# EAGLE design synth-zodiac-aquarius-vco (EAGLE 9.6.2)
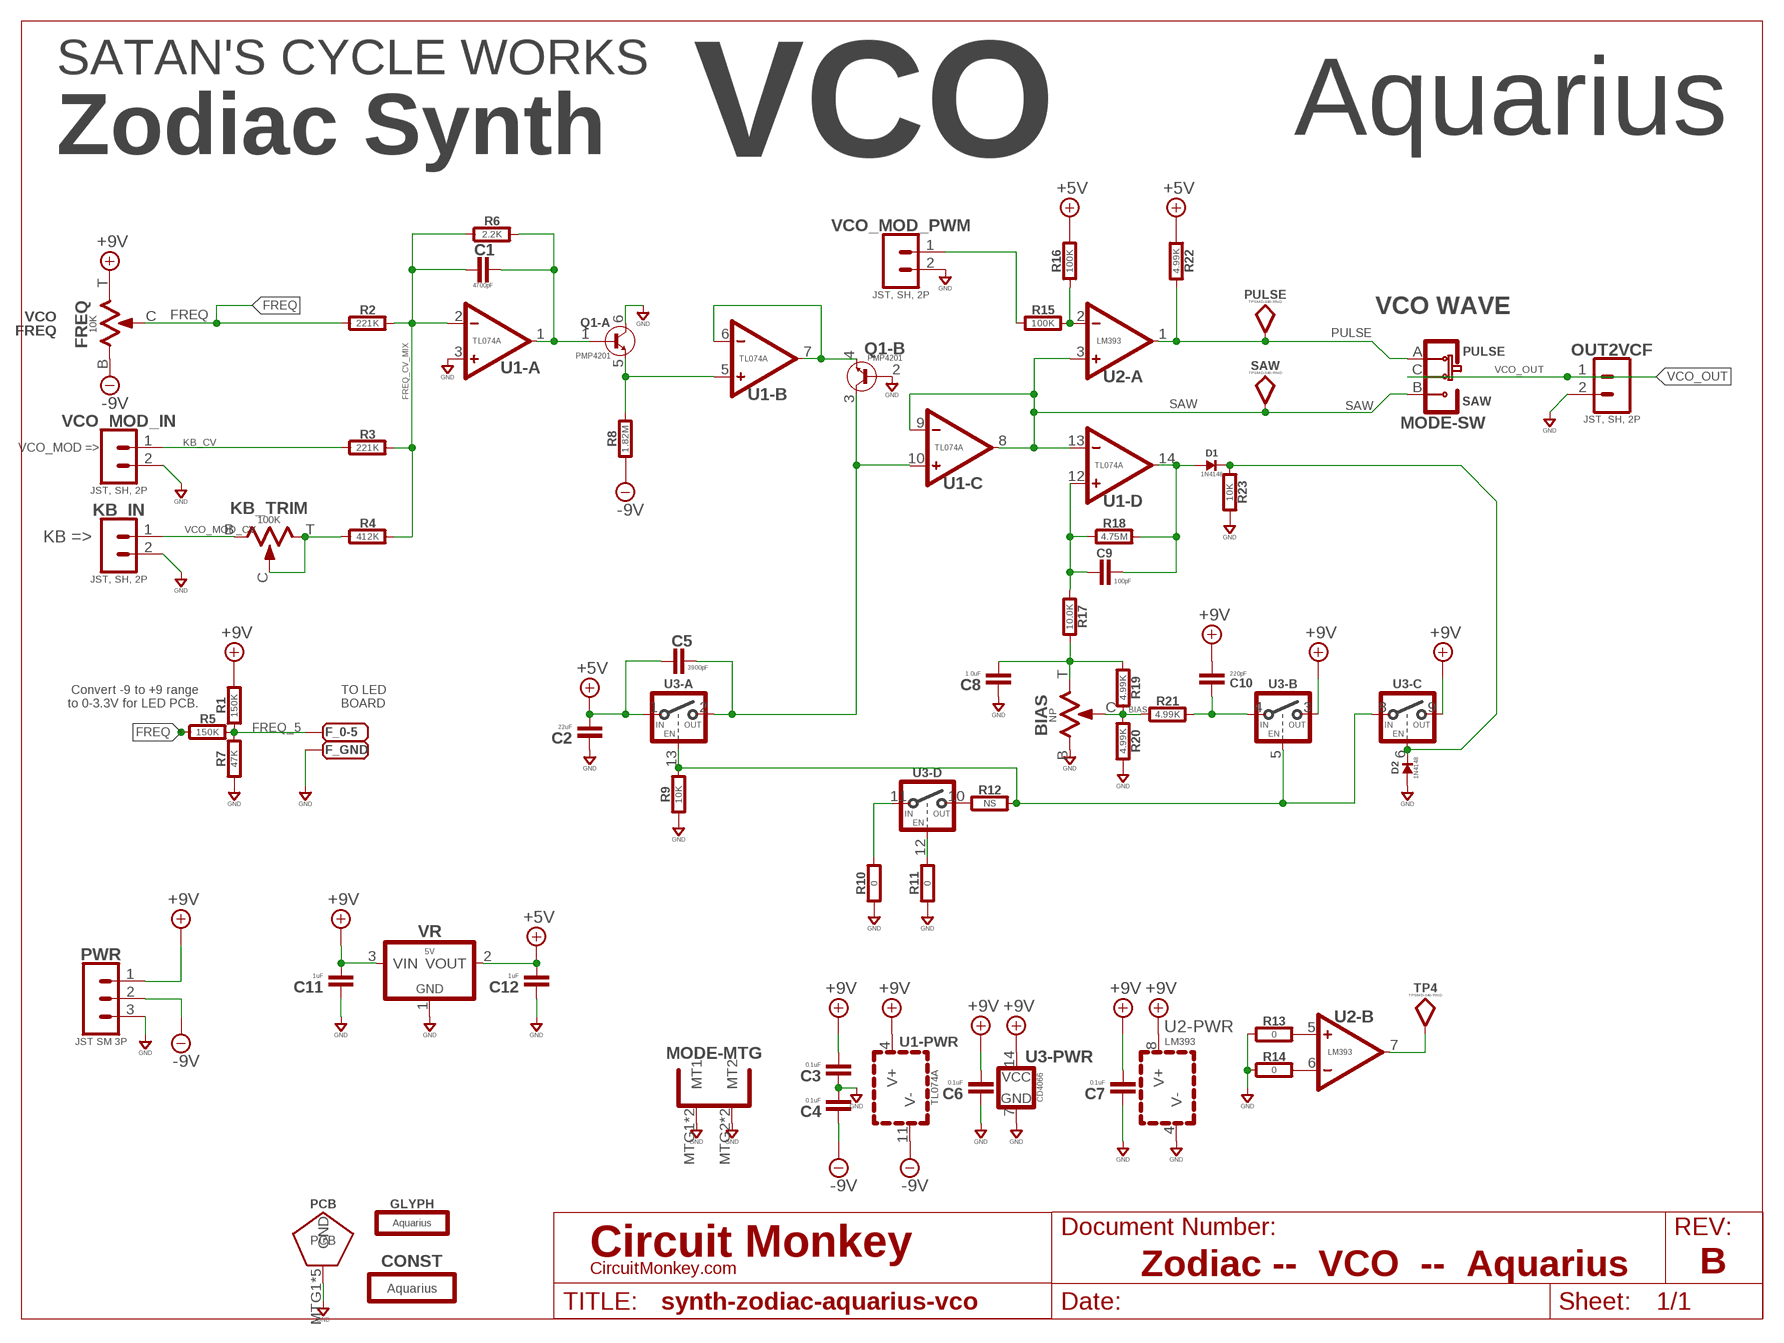
[diagram p0: schematic, sheet 1]
SHEET1 (LETTER_L-CIRCUITMONKEY): DOCUMENT_NUMBER: Zodiac -- VCO -- Aquarius; REV: B

## Parts
BIAS  NP  TRIMPOTTC33X  [TRIM_BOURNS_TC33X]
C1  4700pF  CAPACITOR0603  [0603-CAP]
C2  22uF  CAPACITOR0603  [0603-CAP]
C3  0.1uF  CAPACITOR0603  [0603-CAP]
C4  0.1uF  CAPACITOR0603  [0603-CAP]
C5  3900pF  CAPACITOR0603  [0603-CAP]
C6  0.1uF  CAPACITOR0603  [0603-CAP]
C7  0.1uF  CAPACITOR0603  [0603-CAP]
C8  1.0uF  CAPACITOR0603  [0603-CAP]
C9  100pF  CAPACITOR0603  [0603-CAP]
C10  220pF  CAPACITOR0603  [0603-CAP]
C11  1uF  CAPACITOR0603  [0603-CAP]
C12  1uF  CAPACITOR0603  [0603-CAP]
CONST  Aquarius  CONSTELLATION-AQUARIUS  [AQUARIUS-CONST]
D1  1N4148  DIODE-1N4148  [SOD-123]
D2  1N4148  DIODE-1N4148  [SOD-123]
F_0-5  PADSMD-070X070  [SMD-070MIL]
F_GND  PADSMD-070X070  [SMD-070MIL]
FREQ  10K  TRIMPOT9MM_PCB_SHAFT  [POT-RV9110]
GLYPH  Aquarius  GLYPH-AQUARIUS  [AQUARIUS-GLYPH]
KB_IN  JST, SH, 2P  02P-SM-VT-SMT  [BM02B-SRSS-TB]
KB_TRIM  100K  TRIMPOTTC33X  [TRIM_BOURNS_TC33X]
MODE  SLIDE-SPDT-MNTSS-12-F45-TH-PCB-2  [SS-12-F45-PNL-SMT-2]
OUT2VCF  JST, SH, 2P  02P-SM-VT-SMT  [BM02B-SRSS-TB]
PCB  PCB FAB  PENTAGON-40R  [PENTAGON-40MM-RAD]
PULSE  TPSMD-040-RND  [SMD-040MIL-RND]
PWR  JST SM 3P  03P-SM-VT-SMT  [BM03B-SRSS-TB]
Q1  PMP4201  NPN-DUALPMP4201  [SOT666]
R1  150K  RESISTOR0603  [0603-RES]
R2  221K  RESISTOR0603  [0603-RES]
R3  221K  RESISTOR0603  [0603-RES]
R4  412K  RESISTOR0603  [0603-RES]
R5  150K  RESISTOR0603  [0603-RES]
R6  2.2K  RESISTOR0603  [0603-RES]
R7  47K  RESISTOR0603  [0603-RES]
R8  1.82M  RESISTOR0603  [0603-RES]
R9  10K  RESISTOR0603  [0603-RES]
R10  0  RESISTOR0603  [0603-RES]
R11  0  RESISTOR0603  [0603-RES]
R12  NS  RESISTOR0603  [0603-RES]
R13  0  RESISTOR0603  [0603-RES]
R14  0  RESISTOR0603  [0603-RES]
R15  100K  RESISTOR0603  [0603-RES]
R16  100K  RESISTOR0603  [0603-RES]
R17  10.0K  RESISTOR0603  [0603-RES]
R18  4.75M  RESISTOR0603  [0603-RES]
R19  4.99K  RESISTOR0603  [0603-RES]
R20  4.99K  RESISTOR0603  [0603-RES]
R21  4.99K  RESISTOR0603  [0603-RES]
R22  4.99K  RESISTOR0603  [0603-RES]
R23  10K  RESISTOR0603  [0603-RES]
SAW  TPSMD-040-RND  [SMD-040MIL-RND]
TP4  TPSMD-040-RND  [SMD-040MIL-RND]
U1  TL074A  QUADTL074A-SOIC  [SOP14]
U2  LM393  DUAL-LM393ED  [SOP08]
U3  CD4066  CD4066SO14  [SOP14]
VCO_MOD_IN  JST, SH, 2P  02P-SM-VT-SMT  [BM02B-SRSS-TB]
VCO_MOD_PWM  JST, SH, 2P  02P-SM-VT-SMT  [BM02B-SRSS-TB]
VR  5V  LDO-3P--5V-SOT23  [SOT-23]

## Nets
+5V: C2.2 C5.1 C12.2 R16.2 R22.1 U3.1(-A:IN) VR.2(VOUT)
+9V: C3.2 C6.2 C7.2 C10.2 C11.2 FREQ.T PWR.1 R1.2 U1.4(-PWR:V+) U2.8(-PWR:V+) U3.3(-B:OUT) U3.9(-C:OUT) U3.14(-PWR:VCC) VR.3(VIN)
-9V: C4.1 FREQ.B PWR.2 R8.1 U1.11(-PWR:V-)
BIAS: BIAS.C R19.2 R20.1 R21.1
FREQ: FREQ.C R2.1 R5.1
FREQ_5: F_0-5.1(PAD) R1.1 R5.2 R7.2
FREQ_CV_MIX: C1.1 R2.2 R3.2 R4.2 R6.1 U1.2(-A:-)
GND: BIAS.B C2.1 C3.1 C4.2 C6.1 C7.1 C8.1 C11.1 C12.1 D2.A F_GND.1(PAD) KB_IN.2 MODE.MTG1(-MTG:MT1) MODE.MTG2(-MTG:MT2) MODE.MTG3(-MTG:MT1) MODE.MTG4(-MTG:MT2) OUT2VCF.2 PCB.MTG1(GND) PCB.MTG2(GND) PCB.MTG3(GND) PCB.MTG4(GND) PCB.MTG5(GND) PWR.3 Q1.2(-B:BASE) Q1.6(-A:COLLECTOR) R7.1 R9.1 R10.1 R11.1 R13.1 R14.1 R20.2 R23.2 U1.3(-A:+) U2.4(-PWR:V-) U3.7(-PWR:GND) VCO_MOD_IN.2 VCO_MOD_PWM.2 VR.1(GND)
KB_CV: KB_IN.1 KB_TRIM.B
N$8: KB_TRIM.C KB_TRIM.T R4.1
N$12: Q1.5(-A:EMITTER) R8.2 U1.5(-B:+)
N$13: Q1.4(-B:EMITTER) U1.6(-B:-) U1.7(-B:OUT)
N$14: C1.2 Q1.1(-A:BASE) R6.2 U1.1(-A:OUT)
N$15: R9.2 R12.2 U3.5(-B:EN) U3.8(-C:IN) U3.13(-A:EN)
N$16: C9.1 R17.1 R18.1 U1.12(-D:+)
N$17: R14.2 U2.6(-B:-)
N$18: C9.2 D1.A R18.2 U1.14(-D:OUT)
N$20: C5.2 Q1.3(-B:COLLECTOR) U1.10(-C:+) U3.2(-A:OUT)
N$21: BIAS.T C8.2 R17.2 R19.1
N$22: C10.1 R21.2 U3.4(-B:IN)
N$23: R12.1 U3.10(-D:OUT)
N$24: D1.K D2.K R23.1 U3.6(-C:EN)
N$25: R10.2 U3.11(-D:IN)
N$26: R11.2 U3.12(-D:EN)
N$27: R13.2 U2.5(-B:+)
N$28: R15.2 R16.1 U2.2(-A:-)
N$29: TP4.TP U2.7(-B:OUT)
PULSE: MODE.A(-SW:A) PULSE.TP R22.2 U2.1(-A:OUT)
PWM_CV: R15.1 VCO_MOD_PWM.1
SAW: MODE.B(-SW:B) SAW.TP U1.8(-C:OUT) U1.9(-C:-) U1.13(-D:-) U2.3(-A:+)
VCO_MOD_CV: R3.1 VCO_MOD_IN.1
VCO_OUT: MODE.C(-SW:C) OUT2VCF.1

## Notes on the sheet
- VCO | Aquarius
- SATAN'S CYCLE WORKS
- Zodiac Synth
- VCO WAVE
- VCO
  FREQ
- PULSE
- SAW
- VCO_MOD =>
- KB =>
- Convert -9 to +9 range
  to 0-3.3V for LED PCB.
- TO LED
  BOARD

## Library data of the parts
BIAS KB_TRIM = rlc:TRIMPOT: Potentiometer; MFR: Bourns; MPN: TC33X
C1-C12 = rlc:CAPACITOR: Capacitor; COST01: 0.12; COST10: 0.09; COST100: 0.05
CONST = circuit-monkey-zodiac:CONSTELLATION: Constellations
D1 D2 = diodes:DIODE-: Diode; COST01: 0.20; COST10: 0.18; COST100: 0.10; MPN: 1N4148W
F_0-5 F_GND = con-testpoints:PAD: Solder Pad
FREQ = rlc:TRIMPOT: Potentiometer; COST01: 0.70; COST10: 0.60; COST100: 0.60; MFR: Tayda; MPN: RV9110NO-OS15A00; SKU: A-5517
GLYPH = circuit-monkey-zodiac:GLYPH: Glyph
KB_IN OUT2VCF VCO_MOD_IN VCO_MOD_PWM = con-jst:02P: 2 pin connector; COST01: 0.45; COST10: 0.4; COST100: 0.35; MFR: JST; MPN: BMB02B-SRSS-TB
MODE = switch-thd:SLIDE-SPDT-MNT: Slide Switch, SPDT; COST01: 0.15; COST10: 0.12; COST100: 0.12; MFR: Tayda; MPN: A-659/A-5111/A-5104
PCB = circuit-monkey-zodiac:PENTAGON: Pentagram shaped PCB
PULSE SAW TP4 = con-testpoints:TP: Test Point -- Testpoint
PWR = con-jst:03P: 3 pin connector; COST01: 0.60; COST10: 0.45; COST100: 0.38; MFR: JST; MPN: BM03B-SRSS-TB
Q1 = transistor-bjt:NPN-DUAL: Dual NPN Transistor; COST01: 0.55; COST10: 0.45; COST100: 0.35; MFR: NXP; MPN: PMP4201V
R1-R23 = rlc:RESISTOR: Resistor; COST01: 0.10; COST10: 0.05; COST100: 0.02
U1 = op-amp:QUAD: Quad Op-amp; COST01: 0.95; COST10: 0.70; COST100: 0.55; MFR: ST; MPN: TL074ACDT
U2 = op-amp:DUAL: Dual Op-Amp; COST01: 0.40; COST10: 0.32; COST100: 0.20; MFR: ST; MPN: LM393ED
U3 = logic:CD4066: CD4066 Analog Switch; COST01: 0.55; COST10: 0.45; COST100: 0.35; MFR: TI; MPN: CD4066BM
VR = regulators:LDO-3P-: regulator 3-pin; COST01: 0.66; COST10: 0.56; COST100: 0.39; MFR: Diodes, Inc.; MPN: AP7387-50SA

## Board
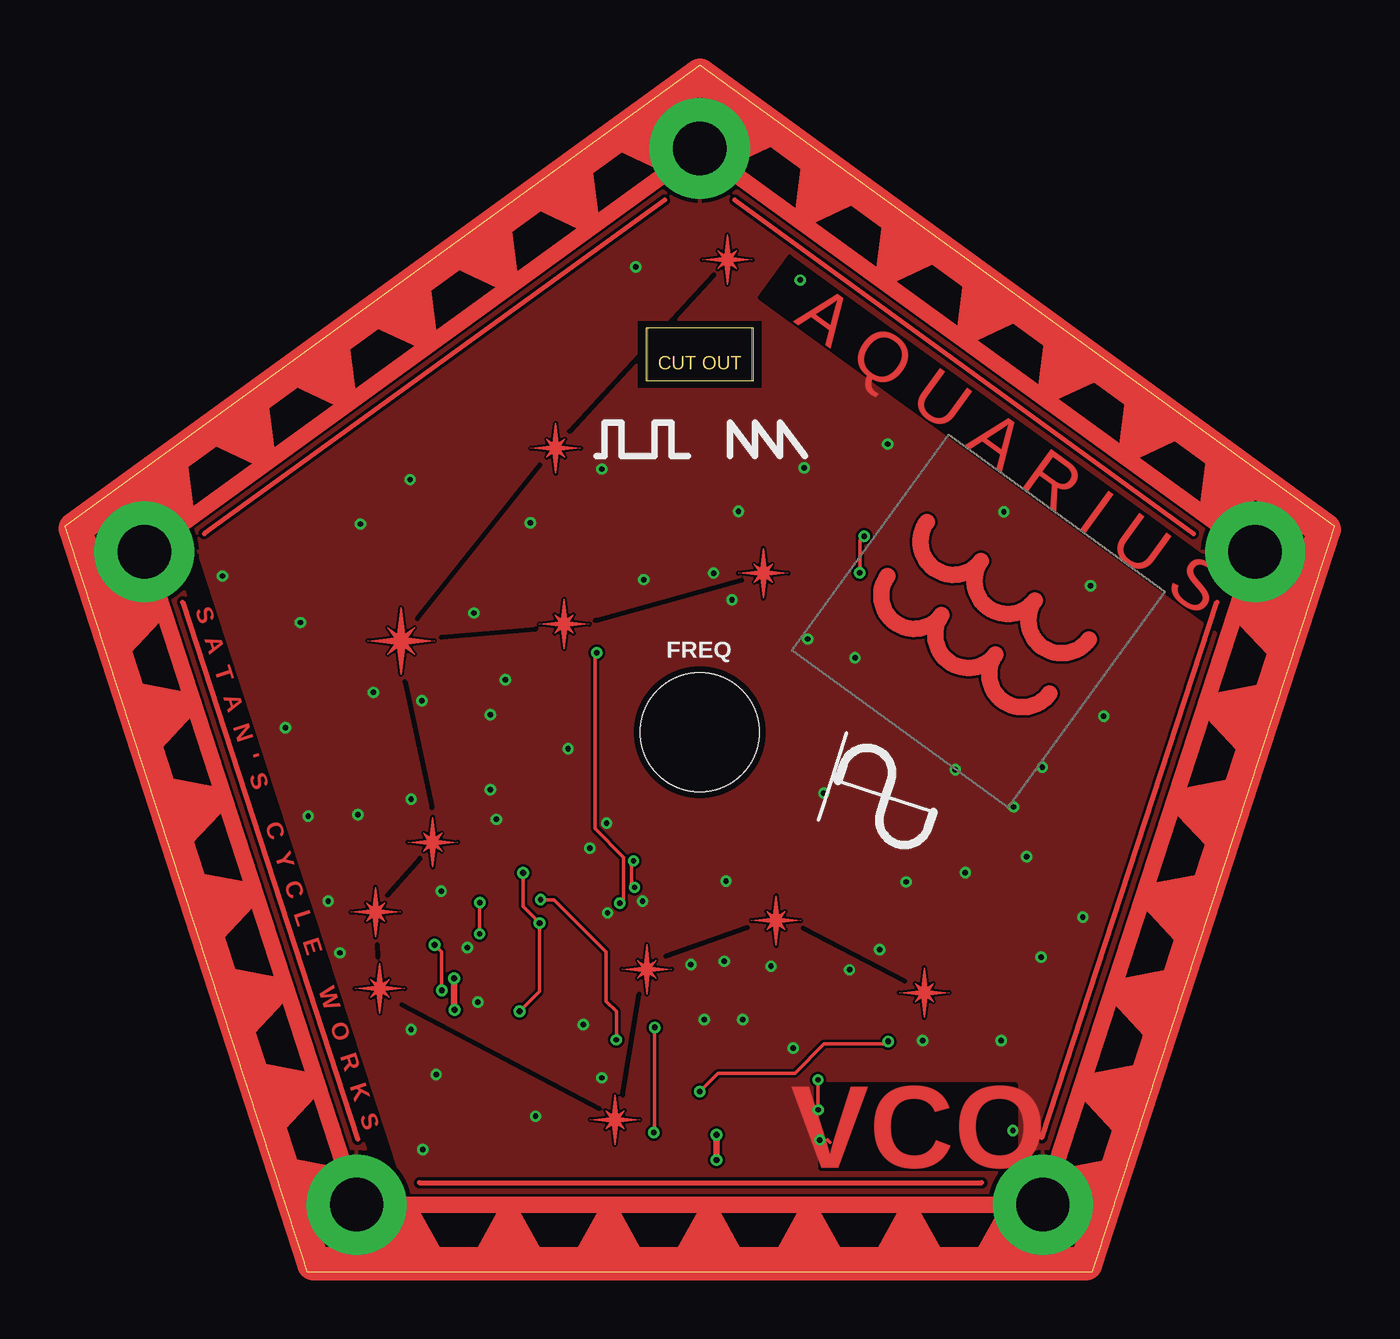
[diagram p1: board, top side]
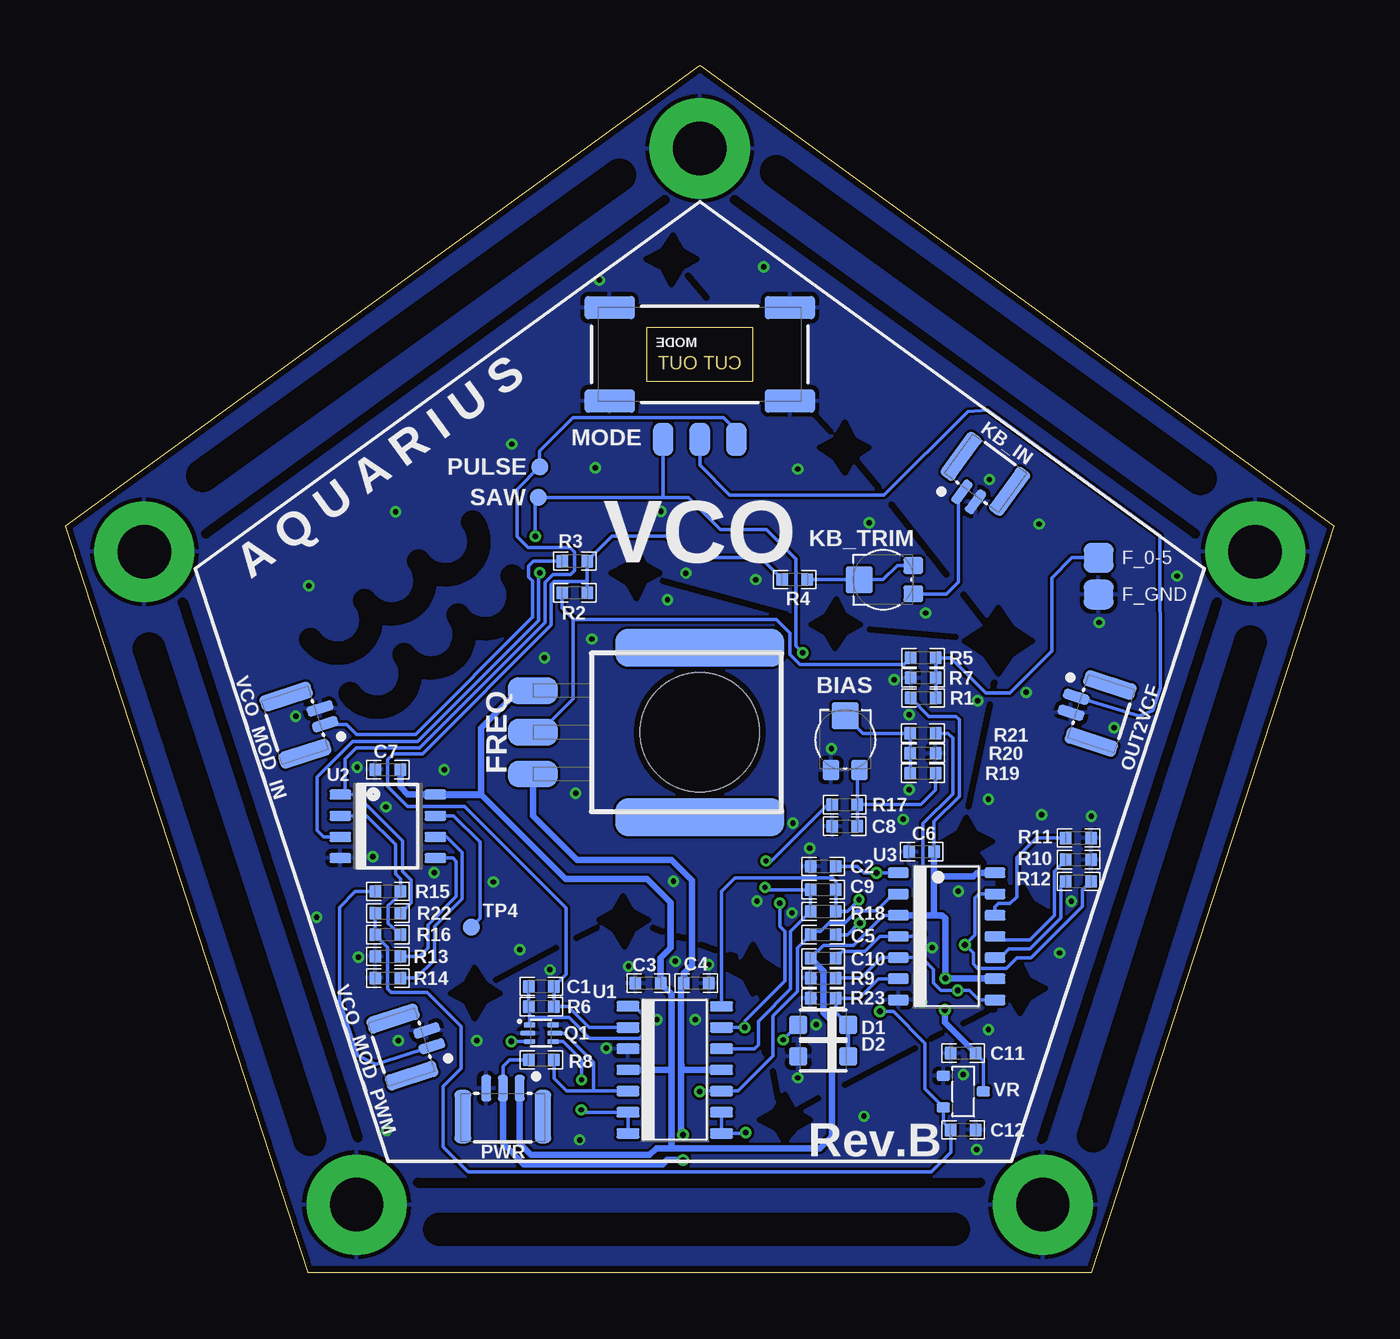
[diagram p2: board, bottom side, seen from below]

Size 76.08 x 72.36 mm. Coordinates in mm from the lower left corner, seen from the top.
Copper layers (1*16): Top 0.0356mm / dielectric 1.5011mm / Bottom 0.0356mm
Design rules "OSH-CircuitMonkey *": minimum track width 0.2mm, minimum drill 12mil, track to track 0.15mm, track to pad 0.15mm, pad to pad 0.15mm, via to via 0.15mm, smd to smd 0.15mm, copper to edge 15mil, drill to drill 6mil, minimum pad ring 7mil, minimum via ring 7mil, stop-mask expansion 3mil, vias tented up to drill 14mil, thermal gap 10mil
bRestrict: area 38.2,59.2 to 41.2,62.1; area 27.9,47.9 to 30.8,50.9; area 18.1,35.9 to 22.1,39.8; area 20.5,24.3 to 23.5,27.2; area 17.2,20.2 to 19.4,23; area 17.3,15.6 to 20.3,18.5; area 31.4,8 to 34.4,10.6; area 33.4,16.7 to 36.2,19.6; area 41.1,19.5 to 44,22.5; area 50,15.2 to 52.9,18.2; area 28.4,37.4 to 31.3,40.3; area 40.4,40.4 to 43.3,43.3; 29 lines

### Footprints (pad centres in the part's own frame; a part is rotated, then mirrored left to right if it is on the bottom)
TRIM_BOURNS_TC33X = smd 1 x 1.2: B -0.85,-1.8; T 0.85,-1.8 | smd 1.6 x 1.6: C 0,1.45
0603-CAP = smd 0.711 x 0.762: 1 -0.752,0; 2 0.752,0
SOD-123 = smd 1.1 x 1.1: A 1.5,0; K -1.5,0
SMD-070MIL = smd 1.778 x 1.778: 1 0.508,0
POT-RV9110 = smd 1.6 x 3: B 2.5,-10; C 0,-10; T -2.5,-10 | smd 2.286 x 10.16: MNT1 -5.08,0; MNT2 5.08,0 | hole 7.1: 0,0
BM02B-SRSS-TB = smd 0.6 x 1.6: 1 -0.5,-0.3; 2 0.5,-0.3 | smd 1 x 3.2: MTG1 1.8,1.4; MTG2 -1.8,1.4
SS-12-F45-PNL-SMT-2 = smd 1.2 x 2 bottom: A -2.2,-5.1; B 2.2,-5.1; C 0,-5.1 | smd 3 x 1.4 bottom: MTG1 -5.4,2.8; MTG2 5.4,2.8; MTG3 -5.4,-2.8; MTG4 5.4,-2.8
PENTAGON-40MM-RAD = drill 3.2 pad 6: MTG1 0,35; MTG2 33.3,10.82; MTG3 20.57,-28.32; MTG4 -20.57,-28.32; MTG5 -33.3,10.82
SMD-040MIL-RND = smd 1.016 x 1.016: TP 0,0
BM03B-SRSS-TB = smd 0.6 x 1.6: 1 -1,-0.3; 2 0,-0.3; 3 1,-0.3 | smd 1 x 3.2: MTG1 2.4,1.4; MTG2 -2.4,1.4
SOT666 = smd 0.32 x 0.7: 1 -0.5,-0.7; 3 0.5,-0.7; 4 0.5,0.7; 6 -0.5,0.7 | smd 0.32 x 0.9: 2 0,-0.8; 5 0,0.8
0603-RES = smd 0.711 x 0.762: 1 -0.752,0; 2 0.752,0
SOP14 = smd 1.4 x 0.635: 1 -2.8,3.81 | smd 1.4 x 0.63: 2 -2.8,2.54; 3 -2.8,1.27; 4 -2.8,0; 5 -2.8,-1.27; 6 -2.8,-2.54; 7 -2.8,-3.81; 8 2.8,-3.81; 9 2.8,-2.54; 10 2.8,-1.27; 11 2.8,0; 12 2.8,1.27; 13 2.8,2.54; 14 2.8,3.81
SOP08 = smd 0.6 x 1.3: 1 -1.905,-2.85; 2 -0.635,-2.85; 3 0.635,-2.85; 4 1.905,-2.85; 5 1.905,2.85; 6 0.635,2.85; 7 -0.635,2.85; 8 -1.905,2.85
SOP14' = smd 1.27 x 0.635: 1 -2.9,3.81; 2 -2.9,2.54; 3 -2.9,1.27; 4 -2.9,0; 5 -2.9,-1.27; 6 -2.9,-2.54; 7 -2.9,-3.81; 8 2.9,-3.81; 9 2.9,-2.54; 10 2.9,-1.27; 11 2.9,0; 12 2.9,1.27; 13 2.9,2.54; 14 2.9,3.81
SOT-23 = smd 0.6 x 0.8: 1 0.95,1.2; 2 -0.95,1.2; 3 0,-1.2

### Placement (x,y rotation side)
BIAS  29.32,31.9 0 bottom
C1  47.54,17.12 180 bottom
C2  30.64,24.32 0 bottom
C3  41.14,17.32 0 bottom
C4  38.24,17.32 0 bottom
C5  30.64,20.22 180 bottom
C6  24.74,25.2 0 bottom
C7  56.74,30.12 0 bottom
C8  29.34,26.72 0 bottom
C9  30.64,22.92 0 bottom
C10  30.64,18.82 180 bottom
C11  22.24,13.12 0 bottom
C12  22.24,8.52 180 bottom
CONST  33.34,30.72 0 top
D1  30.64,14.82 180 bottom
D2  30.64,12.92 180 bottom
F_0-5  14.64,42.82 0 bottom
F_GND  14.64,40.62 0 bottom
FREQ  38.04,32.36 270 bottom
GLYPH  54.74,39.02 324 top
KB_IN  21.74,46.72 324 bottom
KB_TRIM  27.04,41.51 90 bottom
MODE  38.04,55.02 0 top
OUT2VCF  15.34,33.92 252 bottom
PCB  38.04,32.36 0 top
PULSE  47.63,48.28 180 bottom
PWR  49.84,10.72 180 bottom
Q1  47.54,14.32 270 bottom
R1  24.64,34.42 180 bottom
R2  45.54,40.72 0 bottom
R3  45.54,42.62 0 bottom
R4  32.34,41.52 180 bottom
R5  24.64,36.82 0 bottom
R6  47.54,15.92 180 bottom
R7  24.64,35.62 0 bottom
R8  47.54,12.72 0 bottom
R9  30.64,17.62 0 bottom
R10  15.34,24.72 180 bottom
R11  15.34,26.02 180 bottom
R12  15.34,23.42 0 bottom
R13  56.74,18.92 0 bottom
R14  56.74,17.62 0 bottom
R15  56.74,22.82 0 bottom
R16  56.74,20.22 180 bottom
R17  29.34,28.02 0 bottom
R18  30.64,21.62 0 bottom
R19  24.66,29.9 180 bottom
R20  24.66,31.1 0 bottom
R21  24.66,32.3 0 bottom
R22  56.74,21.52 0 bottom
R23  30.64,16.42 180 bottom
SAW  47.71,46.44 180 bottom
TP4  51.74,20.68 180 bottom
U1  39.54,12.12 0 bottom
U2  56.74,26.72 270 bottom
U3  CD4066  [SOP14']  23.24,20.12 0 bottom
VCO_MOD_IN  60.94,33.22 108 bottom
VCO_MOD_PWM  54.54,13.92 108 bottom
VR  22.24,10.82 90 bottom

### Tracks (layer width: path | path; a pad name or v marks a point on that pad's centre or on a via)
+5V  (via drill 0.35)
  Top 0.2: v27.44,23.93 27.44,21.92 v28.44,20.92 28.44,16.82 v27.24,15.62
  Bottom 0.2: C2.2 28.59,24.32 28.2,23.93 v27.44,23.93 U3.1 | R22.1 R16.2 56.74,19.47 56.74,16.97 56.54,16.77 54.39,16.77 52.34,14.72 52.34,12.22 53.44,11.12 53.44,7.52 51.94,6.02 24.14,6.02 22.99,7.17 C12.2 23.44,8.97 VR.2 24.54,10.97 24.54,13.72 26.44,15.62 v27.24,15.62 | C5.1 29.19,20.22 28.49,20.92 v28.44,20.92
+9V  (via drill 0.35)
  Top 0.4: v23.31,17.61 23.31,15.75 v23.34,15.72
  Bottom 0.2: U3.3 27.04,21.39 28.84,19.59 30.62,19.59 C10.2 | VR.3 21.04,12.67 C11.2 | C6.2 23.99,27 22.49,28.5 22.49,33.12 22.69,33.32 24.29,33.32 R1.2
  Bottom 0.4: U3.9 20.37,17.61 v23.31,17.61 23.31,21.19 23.51,21.39 23.94,21.39 | C6.2 23.99,23.72 | C7.2 55.99,29.07 55.55,28.63 U2.8 | C10.2 30.63,18.06 30.63,15.55 30.11,15.03 30.11,8.15 30.84,7.42 39.64,7.42 | FREQ.T 48.1,34.92 48.84,34.92 51.14,32.62 51.14,28.62 46.09,23.57 41.19,23.57 39.79,22.17 39.79,19.42 40.39,18.82 C3.2 39.74,16.67 39.74,13.13 39.74,13.12 39.74,12.12 | 39.64,7.42 40.64,7.42 41.04,7.02 48.14,7.02 48.84,7.72 PWR.1 | U1.4 39.74,12.12 | 39.64,7.42 39.74,7.52 39.74,12.12 | v23.34,15.72 23.34,14.97 C11.2 | U3.14 21.43,23.93 21.64,23.72 23.99,23.72 | 23.94,21.39 U3.3 | 23.94,21.39 23.99,21.44 23.99,23.72
  Bottom 0.406: U2.8 51.15,28.63 51.14,28.62
-9V  (via drill 0.35)
  Top 0.4: v39.04,8.22 v39.04,6.72
  Bottom 0.2: PWR.2 49.84,12.32 49.44,12.72 R8.1
  Bottom 0.4: 39.15,12.41 39.15,17.03 38.99,17.19 C4.1 38.99,17.92 38.49,18.42 38.49,23.47 39.74,24.72 45.41,24.72 48.04,27.35 FREQ.B | U1.11 39.14,12.12 39.14,12.42 39.15,12.41 | PWR.2 49.84,7.72 48.59,6.47 40.24,6.47 39.99,6.72 v39.04,6.72 | v39.04,8.22 39.15,8.34 39.15,12.41
BIAS
  Bottom 0.2: BIAS.C 28.27,32.3 R21.1 R20.1 R19.2
FREQ
  Bottom 0.2: FREQ.C 47.64,32.36 45.64,34.36 45.64,39.12 | 45.64,39.12 45.64,39.14 46.29,39.8 R2.1 | R5.1 25.79,36.42 32.04,36.42 32.64,37.02 32.64,38.32 33.44,39.12 45.64,39.12
FREQ_5
  Bottom 0.2: R1.1 R7.2 R5.2 22.99,36.82 20.89,34.72 19.44,34.72 16.94,37.22 16.94,41.62 15.74,42.82 F_0-5.1
FREQ_CV_MIX
  Bottom 0.2: U1.2 44.68,14.66 45.94,15.92 R6.1 C1.1 46.77,17.12 46.06,17.84 46.06,21.84 52.14,27.92 55.54,27.92 56.74,29.12 56.74,30.72 56.39,31.07 54.66,31.07 46.95,38.78 46.95,41.21 46.77,41.39 44.79,41.39 R2.2 R3.2 43.3,44.11 40.03,44.11 38.74,42.82 34.39,42.82 R4.2
GND  (via drill 0.32)
  Top 0.2: 45.84,7.76 45.68,7.92
  other vias: 45.24,7.92 43.64,13.42 32.16,11.64 40.61,15.13 24.74,16.18 18.48,34.75 17.7,44.84 20.68,47.51 27.89,44.91 32.17,48.14 48.82,19.32 51.41,13.88 56.85,27.88 17.54,27.42 24.1,19.44 34.61,22.23 45.48,28.7 44.52,37.95 47.35,36.83 38.87,41.9 44.31,48.21 40.36,45.61 44.06,59.47 34.2,60.26 49.3,49.64 56.27,45.58 61.48,41.14 53.36,30.12 53.96,23.95 50.42,23.39 58.58,30.27 57.64,24.9 28.2,9.34 25.84,27.14 14.56,27.33 9.43,41.73 30.14,31.37 25.48,28.91 31.45,25.41 32.45,26.91 42.31,18.33 24.49,39.51 26.39,35.51 34.69,41.51 39.97,40.3 20.74,28.34 47.02,18.12 21.38,34.25 56.11,13.88 61.01,21.28 56.81,8.48 58.51,18.88 62.26,33.32 38.31,15.13 37.51,18.43 32.51,21.53 39.61,23.43 39.51,18.63 14.1,38.94 13.2,32.64 25.48,33.41 22.54,22.84 22.24,11.84 21.44,7.34 20.74,14.54 31.06,14.84 15.76,22.23 16.46,19.13
  pour Bottom: 14.94,-0.08 -0.06,44.94 37.85,72.15 76.34,44.52 61.48,-0.08
  pour Top (rank 4): 58.84,3.92 17.5,3.92 4.65,43.17 38,67.54 71.47,43.25
KB_CV
  Bottom 0.2: KB_TRIM.B 23.24,40.66 22.54,41.36 22.54,46.55 KB_IN.1
N$8
  Bottom 0.2: R4.1 31.58,41.51 KB_TRIM.C 27.05,41.51 26.2,42.36 KB_TRIM.T
N$12
  Bottom 0.2: 44.4,10.85 U1.5 | Q1.5 46.14,14.32 44.4,12.58 44.4,10.85 | 44.4,10.85 46.02,10.85 46.79,11.62 R8.2
N$13  (via drill 0.32)
  Top 0.2: v45.14,9.72 45.13,9.73 v45.13,11.52
  Bottom 0.2: U1.7 U1.6 45,9.58 v45.14,9.72 | Q1.4 46.23,13.82 45.13,12.72 v45.13,11.52
N$14
  Bottom 0.2: C1.2 R6.2 48.24,15.87 48.24,15.27 | 48.24,15.27 45.89,15.27 44.64,14.02 41.64,14.02 41.36,14.31 41.36,15.33 41.96,15.93 U1.1 | Q1.1 48.24,15.27
N$15  (via drill 0.35)
  Top 0.2: v22.14,19.62 22.58,19.19 v22.58,16.89
  Bottom 0.2: U3.13 21.3,22.66 21.54,22.42 21.54,20.22 v22.14,19.62 21.64,19.12 21.64,18.47 21.39,18.22 19.64,18.22 19.04,18.82 18.19,18.82 15.09,21.92 15.09,22.92 R12.2 | U3.8 21.31,16.32 21.88,16.89 v22.58,16.89 23.58,16.89 24.04,17.35 24.04,18.15 24.74,18.85 U3.5 27.16,18.85 28.39,17.62 R9.2
N$16  (via drill 0.3)
  Top 0.2: v34.14,23.05 33.94,23.25 33.94,24.52 v34.06,24.64
  Bottom 0.2: R17.1 30.35,28.02 33.73,24.64 v34.06,24.64 | v34.14,23.05 34.01,22.92 C9.1 R18.1 32.59,20.42 32.59,16.97 34.53,15.03 34.53,13.63 34.77,13.39 U1.12
N$17
  Bottom 0.2: U2.6 53.21,26.09 52.29,25.17 52.29,22.37 53.94,20.72 53.94,18.72 55.04,17.62 R14.2
N$18  (via drill 0.32)
  Top 0.2: v28.5,22.32 29.3,22.32 32.43,19.19 32.43,16.23 33.04,15.62 v33.04,13.92
  Bottom 0.2: U1.14 36.74,22.83 35.94,23.63 30.1,23.63 29.89,23.42 C9.2 R18.2 29.2,21.62 v28.5,22.32 | v33.04,13.92 D1.A
N$20  (via drill 0.35)
  Top 0.2: v38.04,10.82 39.14,11.92 43.74,11.92 45.49,13.67 49.19,13.67 v49.34,13.82
  Bottom 0.2: U3.2 26.44,22.66 27.44,21.66 28.61,21.66 29.35,20.92 30.29,20.92 30.79,20.42 31.19,20.42 C5.2 32.19,19.42 32.19,16.82 33.64,15.37 33.64,12.95 35.74,10.85 U1.10 38.01,10.85 v38.04,10.82 | v49.34,13.82 Q1.3
N$21
  Bottom 0.2: R17.2 C8.2 | R19.1 23.91,28.9 24.79,28.02 R17.2 | BIAS.T 28.59,29.95 R17.2
N$22  (via drill 0.32)
  Top 0.2: v24.85,22.15 v24.84,22.14 v24.84,20.27
  Bottom 0.2: C10.1 29.49,19.22 28.13,19.22 27.23,20.12 U3.4 25.32,20.12 25.17,20.27 v24.84,20.27 | v24.85,22.15 24.65,22.35 24.65,26.88 22.86,28.67 22.86,32.01 23.15,32.3 R21.2
N$23
  Bottom 0.2: R12.1 16.39,23.12 16.39,21.22 18.24,19.37 19.52,19.37 20.04,18.85 U3.10
N$24
  Bottom 0.2: U3.6 27.33,17.58 28.49,16.42 R23.1 29.89,15.57 D1.K D2.K
N$25
  Bottom 0.2: R10.2 16.78,24.03 16.78,21.38 18.26,19.9 19.82,19.9 20.04,20.12 U3.11
N$26
  Bottom 0.2: R11.2 17.87,26.02 19.04,24.85 19.04,22.49 19.44,22.09 20.14,22.09 20.34,21.89 U3.12
N$27
  Bottom 0.2: U2.5 52.84,24.82 52.64,24.62 52.64,22.52 54.34,20.82 54.34,19.42 54.84,18.92 R13.2
N$28
  Bottom 0.2: U2.2 58.02,27.36 56.29,25.62 56.29,23.86 55.99,23.56 R15.2 55.99,22.63 56.72,21.99 56.72,20.9 56.3,20.53 R16.1
N$29
  Bottom 0.2: U2.7 52.79,27.36 51.22,25.78 51.22,21.21 TP4.TP
PULSE
  Bottom 0.2: R22.2 55.94,21.52 55.34,22.12 55.34,23.5 55.85,24.01 55.85,25.84 58.64,28.63 U2.1 59.31,28.91 59.31,30.75 58.64,31.42 54.84,31.42 47.32,38.94 47.32,41.34 46.84,41.82 45.79,41.82 45.54,42.07 45.54,43.15 45.81,43.42 48.34,43.42 49,44.08 48.99,46.92 PULSE.TP 47.63,49.23 45.64,51.22 36.61,51.22 35.84,50.45 MODE.A
PWM_CV
  Bottom 0.2: R15.1 58.69,22.82 59.64,21.87 59.64,16.22 58.56,12.99 57.49,12.45 VCO_MOD_PWM.1
SAW  (via drill 0.32, 0.33, 0.35)
  Top 0.2: v33.24,22.12 33.48,22.36 33.48,24.87 31.75,26.6 31.76,36.93 31.86,37.04 v31.86,37.13 | v47.91,44.12 47.64,43.85 v47.64,41.92 | v35.34,14.66 35.34,8.42 v35.29,8.37
  Bottom 0.2: U1.9 U1.8 35.34,8.31 v35.29,8.37 | v47.91,44.12 47.91,46.24 SAW.TP 40.24,46.44 | U2.3 60.59,26.09 60.97,26.47 60.97,29.69 58.84,31.82 54.94,31.82 47.69,39.07 47.69,41.87 v47.64,41.92 | U1.13 v35.34,14.66 35.34,15.06 32.94,17.46 32.94,20.42 33.24,20.72 v33.24,22.12 | v31.86,37.13 32.26,37.53 32.26,42.74 34.04,44.52 36.8,44.52 38.72,46.44 40.24,46.44 | MODE.B 40.24,46.44
VCO_MOD_CV
  Bottom 0.2: R3.1 47.99,42.62 48.29,42.32 48.29,41.67 48.05,41.43 48.05,39.26 55.07,32.24 58.6,32.24 59.2,32.84 VCO_MOD_IN.1
VCO_OUT
  Bottom 0.2: OUT2VCF.1 11.67,33.35 10.87,33.65 10.43,35.03 10.45,44.16 20.78,51.69 21.95,51.6 26.99,46.59 36.25,46.59 38.04,48.38 MODE.C

### Text on the board
Top: A Q U A R I U S | S A T A N ' S C Y C L E W O R K S | VCO
bPlace: A Q U A R I U S | VCO | Rev.B
tStop: A Q U A R I U S | S A T A N ' S C Y C L E W O R K S | VCO